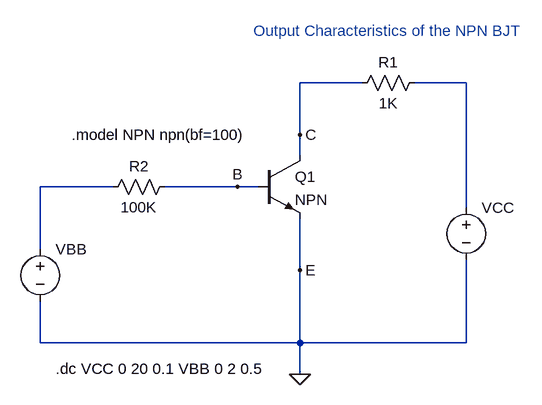
[diagram p0: schematic BJT_input_characteristic.asc]
BJT_input_characteristic.asc, the LTspice schematic file:
Version 4
SHEET 1 880 680
WIRE 304 144 208 144
WIRE 464 144 384 144
WIRE 208 224 208 144
WIRE 208 256 208 224
WIRE -80 304 -192 304
WIRE 112 304 0 304
WIRE 144 304 112 304
WIRE 464 336 464 144
WIRE -192 400 -192 304
WIRE 208 432 208 352
WIRE -192 544 -192 480
WIRE 208 544 208 432
WIRE 208 544 -192 544
WIRE 464 544 464 416
WIRE 464 544 208 544
WIRE 208 592 208 544
FLAG 208 592 0
FLAG 112 304 B
FLAG 208 224 C
FLAG 208 432 E
SYMBOL npn 144 256 R0
SYMATTR InstName Q1
SYMBOL res -96 320 R270
WINDOW 0 32 56 VTop 2
WINDOW 3 0 56 VBottom 2
SYMATTR InstName R2
SYMATTR Value 100K
SYMBOL res 400 128 R90
WINDOW 0 0 56 VBottom 2
WINDOW 3 32 56 VTop 2
SYMATTR InstName R1
SYMATTR Value 1K
SYMBOL voltage -192 384 R0
WINDOW 3 24 96 Invisible 2
SYMATTR InstName VBB
SYMATTR Value ""
SYMBOL voltage 464 320 R0
WINDOW 3 24 96 Invisible 2
SYMATTR InstName VCC
SYMATTR Value ""
TEXT 136 64 Left 2 ;Output Characteristics of the NPN BJT
TEXT -144 224 Left 2 !.model NPN npn(bf=100)
TEXT -168 584 Left 2 !.dc VCC 0 20 0.1 VBB 0 2 0.5

The netlist it stands for:
* BJT_input_characteristic.asc
Q1 C B 0 0 NPN
R2 N002 B 100K
R1 N001 C 1K
VBB N002 0
VCC N001 0
.model NPN NPN
.model PNP PNP
.lib standard.bjt
* Output Characteristics of the NPN BJT
.model NPN npn(bf=100)
.dc VCC 0 20 0.1 VBB 0 2 0.5
.backanno
.end